# Altium schematic sheet Designator Buzzer piezo PB1475.SchDoc
size 209 x 297 mm; Scale: 1:1; Letter1Column: Э
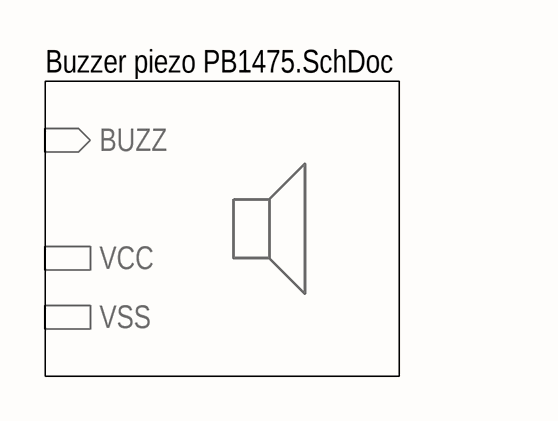
[diagram p0: Designator Buzzer piezo PB1475.SchDoc]

## Sub-sheets
D? = Buzzer piezo PB1475.SchDoc: VSS, VCC, BUZZ (in)

## Notes on the sheet
- Перв. примен.
- Справ. №
- Подп. и дата
- Инв. № дубл.
- Взам. инв. №
- Разраб.
- Изм.
- Лист
- № докум.
- Подп.
- Дата
- Лит.
- Масса
- Масштаб
- Пров.
- Т.контр.
- Листов
- Инв. № подл.
- Утв.
- Н.контр.
- 2.106-A4
- Копировал
- Формат А4